# Altium schematic sheet Connectors.SchDoc
size 431 x 279 mm; SheetNumber: 4; SheetTotal: 6
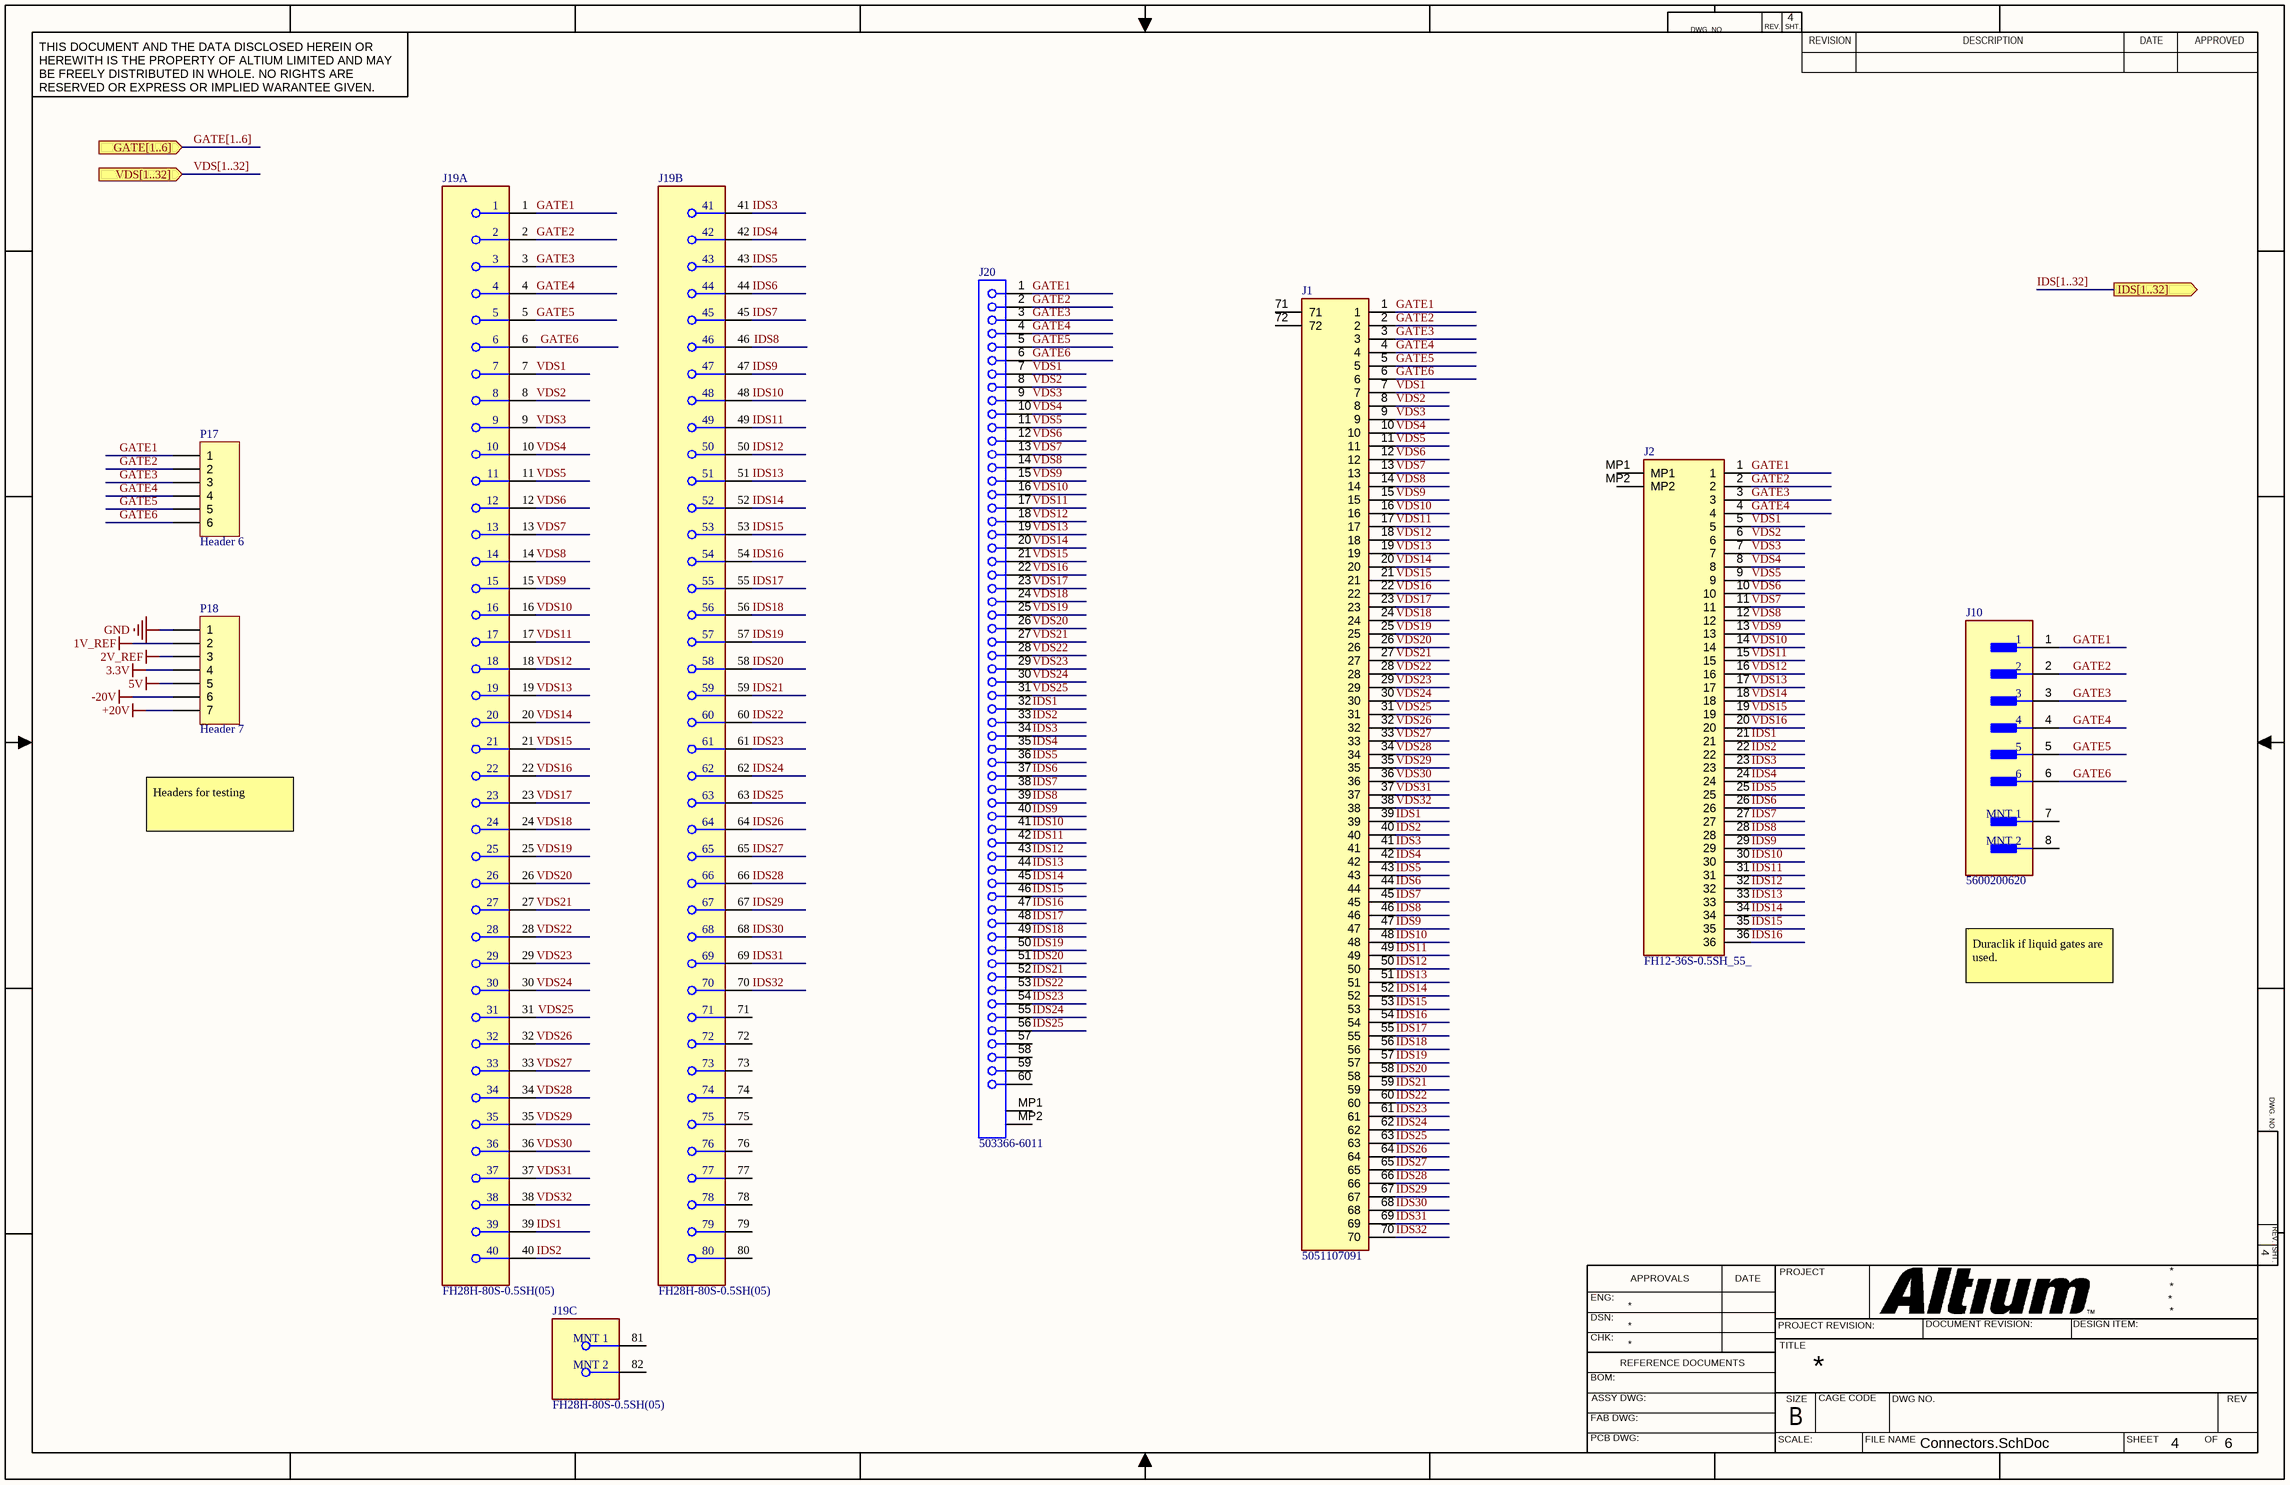
[diagram p0: Connectors.SchDoc]

## Parts
J1  5051107091  [5051107091]
J2  FH12-36S-0.5SH_55_  [FH1236S05SH55]
J10  5600200620  [FP-5600200620-MFG]
J19  FH28H-80S-0.5SH(05)  [FP-FH28H-80S-0_5SH_05-MFG]  (parts A,B,C of 3)
J20  503366-6011  [MOLX-503366-6011]
P17  Header 6  [HDR1X6]
P18  Header 7  [HDR1X7]

## Ports
GATE[1..6] (in), IDS[1..32] (out), VDS[1..32] (in)

## Nets
1V_REF: P18.2
2V_REF: P18.3
3.3V: P18.4
5V: P18.5
+20V: P18.7
-20V: P18.6
GND: P18.1
GATE1: J1.1 J2.1 J10.1 J19.1 J20.1 P17.1
GATE2: J1.2 J2.2 J10.2 J19.2 J20.2 P17.2
GATE3: J1.3 J2.3 J10.3 J19.3 J20.3 P17.3
GATE4: J1.4 J2.4 J10.4 J19.4 J20.4 P17.4
GATE5: J1.5 J10.5 J19.5 J20.5 P17.5
GATE6: J1.6 J10.6 J19.6 J20.6 P17.6
IDS1: J1.39 J2.21 J19.39 J20.32
IDS2: J1.40 J2.22 J19.40 J20.33
IDS3: J1.41 J2.23 J19.41 J20.34
IDS4: J1.42 J2.24 J19.42 J20.35
IDS5: J1.43 J2.25 J19.43 J20.36
IDS6: J1.44 J2.26 J19.44 J20.37
IDS7: J1.45 J2.27 J19.45 J20.38
IDS8: J1.46 J2.28 J19.46 J20.39
IDS9: J1.47 J2.29 J19.47 J20.40
IDS10: J1.48 J2.30 J19.48 J20.41
IDS11: J1.49 J2.31 J19.49 J20.42
IDS12: J1.50 J2.32 J19.50 J20.43
IDS13: J1.51 J2.33 J19.51 J20.44
IDS14: J1.52 J2.34 J19.52 J20.45
IDS15: J1.53 J2.35 J19.53 J20.46
IDS16: J1.54 J2.36 J19.54 J20.47
IDS17: J1.55 J19.55 J20.48
IDS18: J1.56 J19.56 J20.49
IDS19: J1.57 J19.57 J20.50
IDS20: J1.58 J19.58 J20.51
IDS21: J1.59 J19.59 J20.52
IDS22: J1.60 J19.60 J20.53
IDS23: J1.61 J19.61 J20.54
IDS24: J1.62 J19.62 J20.55
IDS25: J1.63 J19.63 J20.56
IDS26: J1.64 J19.64
IDS27: J1.65 J19.65
IDS28: J1.66 J19.66
IDS29: J1.67 J19.67
IDS30: J1.68 J19.68
IDS31: J1.69 J19.69
IDS32: J1.70 J19.70
VDS1: J1.7 J2.5 J19.7 J20.7
VDS2: J1.8 J2.6 J19.8 J20.8
VDS3: J1.9 J2.7 J19.9 J20.9
VDS4: J1.10 J2.8 J19.10 J20.10
VDS5: J1.11 J2.9 J19.11 J20.11
VDS6: J1.12 J2.10 J19.12 J20.12
VDS7: J1.13 J2.11 J19.13 J20.13
VDS8: J1.14 J2.12 J19.14 J20.14
VDS9: J1.15 J2.13 J19.15 J20.15
VDS10: J1.16 J2.14 J19.16 J20.16
VDS11: J1.17 J2.15 J19.17 J20.17
VDS12: J1.18 J2.16 J19.18 J20.18
VDS13: J1.19 J2.17 J19.19 J20.19
VDS14: J1.20 J2.18 J19.20 J20.20
VDS15: J1.21 J2.19 J19.21 J20.21
VDS16: J1.22 J2.20 J19.22 J20.22
VDS17: J1.23 J19.23 J20.23
VDS18: J1.24 J19.24 J20.24
VDS19: J1.25 J19.25 J20.25
VDS20: J1.26 J19.26 J20.26
VDS21: J1.27 J19.27 J20.27
VDS22: J1.28 J19.28 J20.28
VDS23: J1.29 J19.29 J20.29
VDS24: J1.30 J19.30 J20.30
VDS25: J1.31 J19.31 J20.31
VDS26: J1.32 J19.32
VDS27: J1.33 J19.33
VDS28: J1.34 J19.34
VDS29: J1.35 J19.35
VDS30: J1.36 J19.36
VDS31: J1.37 J19.37
VDS32: J1.38 J19.38

Not connected (* = marked no-connect by the designer): J1 71 72; J2 MP1 MP2; J10 7(MNT_1) 8(MNT_2); J19 71 72 73 74 75 76 77 78 79 80 81(MNT_1) 82(MNT_2); J20 57 58 59 60 MP1 MP2

## Buses and harness runs
bus GATE[1..6] = port GATE[1..6]
bus IDS[1..32] = port IDS[1..32]
bus VDS[1..32] = port VDS[1..32]

## Notes on the sheet
- Headers for testing
- Duraclik if liquid gates are used.
- DWG. NO.
- REV.
- SHT.
- THIS DOCUMENT AND THE DATA DISCLOSED HEREIN OR HEREWITH IS THE PROPERTY OF ALTIUM LIMITED AND MAY BE FREELY DISTRIBUTED IN WHOLE. NO RIGHTS ARE RESERVED OR EXPRESS OR IMPLIED WARANTEE GIVEN.
- REVISION
- DESCRIPTION
- DATE
- APPROVED
- ENG:
- APPROVALS
- PROJECT
- DSN:
- CHK:
- REFERENCE DOCUMENTS
- PROJECT REVISION:
- TITLE
- DOCUMENT REVISION:
- DESIGN ITEM:
- BOM:
- FAB DWG:
- PCB DWG:
- ASSY DWG:
- SCALE:
- SIZE
- B
- CAGE CODE
- FILE NAME
- DWG NO.
- SHEET
- OF
- REV

## Library data of the parts
J1 = 5051107091: Connector; Manufacturer_Name: Molex; Datasheet Link: https://www.molex.com/webdocs/datasheets/pdf/en-us/5051107091_FFC_FPC_CONNECTORS.pdf; Height: 2.1mm; Manufacturer_Part_Number: 5051107091; Arrow Part Number: 5051107091; Arrow Price/Stock: https://www.arrow.com/en/products/5051107091/molex?region=nac
J2 = FH12-36S-0.5SH_55_: Connector; Manufacturer_Name: Hirose; Manufacturer_Part_Number: FH12-36S-0.5SH(55); Datasheet Link: https://www.hirose.com/product/document?clcode=CL0586-0526-4-55&productname=FH12-36S-0.5SH(55)&series=FH12&documenttype=2DDrawing&lang=en&documentid=0000987484; Height: 2.2mm; Mouser Part Number: 798-FH12-36S-0.5SH55; Mouser Price/Stock: https://www.mouser.co.uk/ProductDetail/Hirose-Connector/FH12-36S-05SH55?qs=Ux3WWAnHpjBt9PREjhnzAA%3D%3D; Arrow Part Number: FH12-36S-0.5SH(55); Arrow Price/Stock: https://www.arrow.com/en/products/fh12-36s-0.5sh-55/hirose-electric
J10 = CMP-04776-000066-1: CONN HEADER SMD 6POS 2MM; Manufacturer: Molex; Conn Gender: Male; Conn Orientation: Vertical; Current Rating: 3A; Number Of Contacts: 6; Voltage Rating: 125V; Lead Free: Yes; Device Class L2: Headers and Wire Housings; Footprint Url: https://www.molex.com/pdm_docs/sd/5600200320_sd.pdf; Octopart: https://octopart.com/5600200620-molex-51767481; RoHS: TRUE; Pitch: 2mm; ComponentLink2Description: Datasheet; Device Class L3: unset; Digikey Description: CONN HEADER SMD 6POS 2MM; Automotive: No; Temperature: -40°C to +125°C; Contact Material: Tin,Nickel; ComponentLink2URL: https://www.molex.com/webdocs/datasheets/pdf/en-us/5600200320_PCB_HEADERS.pdf; Package: 5600200620; Height: 8.2mm; Temperature Range High: +125°C; Number Of Rows: 1; Category: Conn; Temperature Range Low: -40°C; Manufacturer Part Number: 5600200620; Device Class L1: Connectors
J19 = CMP-11609-000031-1: CONN FFC BOTTOM 80POS 0.50MM R/A; Number of Positions: 80; Voltage Rating: 50V; Contact Resistance: 50mR; Max Current Rating: 500mA; Gender: Receptacle; Pitch: 0.5mm; Mating Cycles: 20; Actuator Material: Polymer; Insulation Resistance: 500MR; Contact Plating: Gold; Orientation: Right Angle; Contact Material: Bronze; Number of Rows: 1; Max Operating Temperature: 85°C; Number of Contacts: 80; Flammability Rating: UL94 V-0; Lead Pitch: 0.5mm; Length: 44.9mm; Radiation Hardening: No; Packaging: Tape and Reel; RoHS Compliant: Yes; REACH SVHC: No SVHC; Current Rating: 500mA; Housing Color: Grey; Depth: 6.5mm; Min Operating Temperature: -40°C; Series: FH28; Termination: Solder; Package Quantity: 1; Housing Material: Polymer; Mount: Surface Mount; Max Voltage Rating (AC): 50V
J20 = CMP-1241-00108-1: 0.5 mm Pitch Easy-On(TM) FPC Connector, 2.0 mm Mated Height, Right Angle, SMT, Bottom Contact, 60 Circuits, -20 to 85 degC, ELV and RoHS Compliant, Tape and Reel; Manufacturer: Molex; Material - Plating Termination: Tin; Mated Height: 2.00mm; Pitch - Termination Interface: 0.50mm; Material - Metal: Phosphor Bronze; Polarized to PCB: No; Circuits (maximum): 60; Material - Plating Mating: Gold over Nickel; PCB Retention: Yes; Voltage (Max): 50V DC; Durability (mating cycles max): 20; Current (Max per Contact): 0.5A; Entry Angle: Vertical; ComponentLink3Description: Package Specification; ComponentLink1Description: Manufacturer URL; PackageDescription: 60-Lead FPC Connector, Pitch 0.5 mm; Number of Rows: 1; PackageVersion: Rev. A, 04/2010; Packing: Tape and Reel; PartNumber: 503366-6011; ComponentLink2URL: http://www.molex.com/webdocs/datasheets/pdf/en-us/5033666011_FFC_FPC_CONNECTORS.pdf; Circuits (Loaded): 60; Contact Position: Bottom; ComponentLink1URL: http://www.molex.com/molex/index.jsp; Mounting Technology: Surface Mount; ComponentLink2Description: Datasheet; ComponentLink3URL: http://www.molex.com/pdm_docs/sd/5033666011_sd.pdf; Pitch - Mating Interface: 0.50mm; PCB Locator: No; PackageReference: 503366-6011; Stackable: No; Orientation: Right Angle; RoHS: TRUE
P17 = Header 6: Header, 6-Pin; LatestRevisionDate: 17-Jul-2002; LatestRevisionNote: Re-released for DXP Platform.; Publisher: Altium Limited
P18 = Header 7: Header, 7-Pin; LatestRevisionDate: 17-Jul-2002; LatestRevisionNote: Re-released for DXP Platform.; Publisher: Altium Limited